# EAGLE design adsr_v3 (EAGLE 7.1.0)
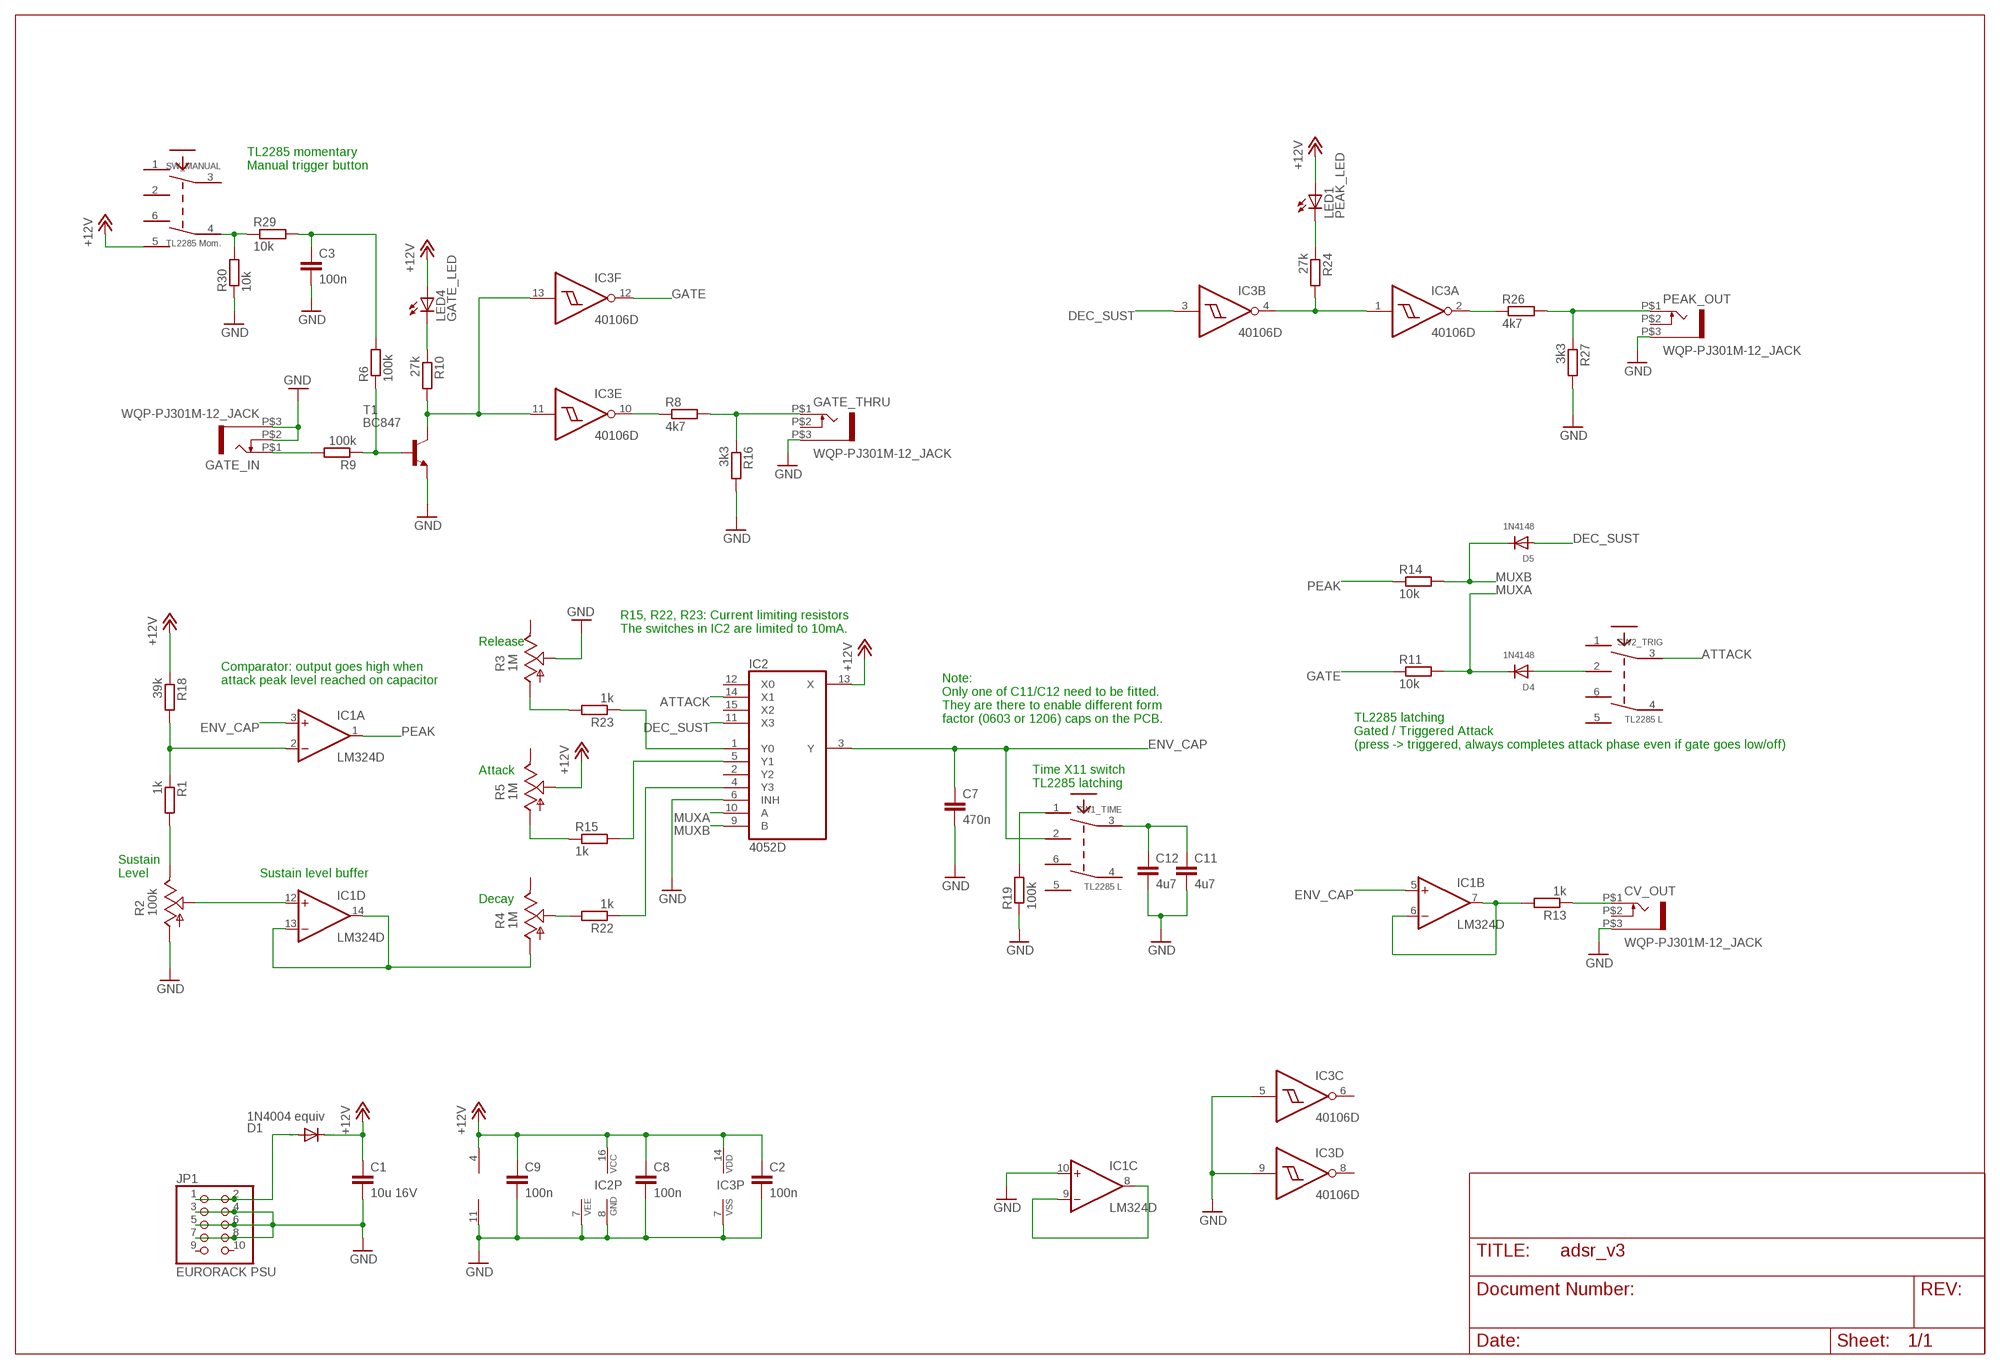
[diagram p0: schematic, sheet 1]

## Parts
C1  10u 16V  C-EUC1206K  [C1206K]
C2  100n  C-EUC0603K  [C0603K]
C3  100n  C-EUC0603K  [C0603K]
C7  470n  C-EUC0603K  [C0603K]
C8  100n  C-EUC0603K  [C0603K]
C9  100n  C-EUC0603K  [C0603K]
C11  4u7  C-EUC1206K  [C1206K]
C12  4u7  C-EUC0603K  [C0603K]
CV_OUT  WQP-PJ301M-12_JACK  [WQP-PJ301M-12_JACK]
D1  1N4004 equiv  DIODE-DO214AA  [DO214AA]
D4  1N4148  DIODESOD-323F  [SOD-323F]
D5  1N4148  DIODESOD-323F  [SOD-323F]
GATE_IN  WQP-PJ301M-12_JACK  [WQP-PJ301M-12_JACK]
GATE_THRU  WQP-PJ301M-12_JACK  [WQP-PJ301M-12_JACK]
IC1  LM324D  [SO14]
IC2  4052D  [SO16]
IC3  40106D  [SO14]
JP1  EURORACK PSU  PINHD-2X5  [2X05]
LED1  PEAK_LED  LED5MM  [LED5MM]
LED4  GATE_LED  LED5MM  [LED5MM]
PEAK_OUT  WQP-PJ301M-12_JACK  [WQP-PJ301M-12_JACK]
R1  1k  R-EU_R0603  [R0603]
R2  100k  POT_USVERTICAL  [ALPS_POT_VERTICAL]
R3  1M  POT_USVERTICAL  [ALPS_POT_VERTICAL]
R4  1M  POT_USVERTICAL  [ALPS_POT_VERTICAL]
R5  1M  POT_USVERTICAL  [ALPS_POT_VERTICAL]
R6  100k  R-EU_R0603  [R0603]
R8  4k7  R-EU_R0603  [R0603]
R9  100k  R-EU_R0603  [R0603]
R10  27k  R-EU_R0603  [R0603]
R11  10k  R-EU_R0603  [R0603]
R13  1k  R-EU_R0603  [R0603]
R14  10k  R-EU_R0603  [R0603]
R15  1k  R-EU_R0603  [R0603]
R16  3k3  R-EU_R0603  [R0603]
R18  39k  R-EU_R0603  [R0603]
R19  100k  R-EU_R0603  [R0603]
R22  1k  R-EU_R0603  [R0603]
R23  1k  R-EU_R0603  [R0603]
R24  27k  R-EU_R0603  [R0603]
R26  4k7  R-EU_R0603  [R0603]
R27  3k3  R-EU_R0603  [R0603]
R29  10k  R-EU_R0603  [R0603]
R30  10k  R-EU_R0603  [R0603]
SW1_TIME  TL2285 L  TL2285  [TL2285_PCB]
SW2_TRIG  TL2285 L  TL2285  [TL2285_PCB]
SW_MANUAL  TL2285 Mom.  TL2285  [TL2285_PCB]
T1  BC847  [SOT23]

## Nets
+12V: C1.1 C2.1 C8.1 C9.1 D1.C IC1.4(P:V+) IC2.13(X) IC2.16(VCC) IC3.14(P:VDD) LED1.A LED4.A R5.P$2(S) R18.1 SW_MANUAL.5
ATTACK: IC2.14(X1) SW2_TRIG.3
ATTACK_REF: IC1.2(A:-IN) R1.1 R18.2
DEC_SUST: D5.A IC2.11(X3) IC3.3(B:I)
ENV_CAP: C7.1 IC1.3(A:+IN) IC1.5(B:+IN) IC2.3(Y) SW1_TIME.2
GATE: IC3.12(F:O) R11.1
GATE_IN: IC3.11(E:I) IC3.13(F:I) R10.2 T1.3(C)
GND: C1.2 C2.2 C3.2 C7.2 C8.2 C9.2 C11.2 C12.2 CV_OUT.P$3 GATE_IN.P$2 GATE_IN.P$3 GATE_THRU.P$3 IC1.10(C:+IN) IC1.11(P:V-) IC2.6(INH) IC2.7(VEE) IC2.8(GND) IC3.5(C:I) IC3.7(P:VSS) IC3.9(D:I) JP1.3 JP1.4 JP1.5 JP1.6 JP1.7 JP1.8 PEAK_OUT.P$3 R2.P$3(A) R3.P$2(S) R16.2 R19.1 R27.2 R30.1 T1.2(E)
MUXA: D4.C IC2.10(A) R11.2
MUXB: D5.C IC2.9(B) R14.2
N$1: IC3.10(E:O) R8.1
N$2: GATE_IN.P$1 R9.2
N$3: D1.A JP1.1 JP1.2
N$4: R29.1 R30.2 SW_MANUAL.4
N$5: IC2.1(Y0) R23.1
N$6: IC2.4(Y3) R22.1
N$7: IC1.13(D:-IN) IC1.14(D:OUT) R4.P$3(A)
N$8: IC3.2(A:O) R26.1
N$10: IC2.5(Y1) R15.2
N$11: CV_OUT.P$1 R13.1
N$12: IC1.6(B:-IN) IC1.7(B:OUT) R13.2
N$13: GATE_THRU.P$1 R8.2 R16.1
N$15: C3.1 R6.2 R29.2
N$16: C11.1 C12.1 SW1_TIME.3
N$18: R19.2 SW1_TIME.1
N$21: R6.1 R9.1 T1.1(B)
N$22: LED4.K(C) R10.1
N$23: R3.P$3(A) R23.2
N$24: IC1.8(C:OUT) IC1.9(C:-IN)
N$25: R5.P$3(A) R15.1
N$26: R1.2 R2.P$1(E)
N$27: D4.A SW2_TRIG.2
N$28: R4.P$2(S) R22.2
N$30: IC3.1(A:I) IC3.4(B:O) R24.2
N$31: LED1.K(C) R24.1
N$35: PEAK_OUT.P$1 R26.2 R27.1
PEAK: IC1.1(A:OUT) R14.1
SUST_LEVEL: IC1.12(D:+IN) R2.P$2(S)
Unconnected: CV_OUT.P$2 GATE_THRU.P$2 IC2.2(Y2) IC2.12(X0) IC2.15(X2) IC3.6(C:O) IC3.8(D:O) JP1.9 JP1.10 PEAK_OUT.P$2 R3.P$1(E) R4.P$1(E) R5.P$1(E) SW1_TIME.4 SW1_TIME.5 SW1_TIME.6 SW2_TRIG.1 SW2_TRIG.4 SW2_TRIG.5 SW2_TRIG.6 SW_MANUAL.1 SW_MANUAL.2 SW_MANUAL.3 SW_MANUAL.6

## Notes on the sheet
- TL2285 momentary
  Manual trigger button
- R15, R22, R23: Current limiting resistors
  The switches in IC2 are limited to 10mA.
- Release
- Comparator: output goes high when
  attack peak level reached on capacitor
- Note:
  Only one of C11/C12 need to be fitted.
  They are there to enable different form
  factor (0603 or 1206) caps on the PCB.
- TL2285 latching
  Gated / Triggered Attack
  (press -> triggered, always completes attack phase even if gate goes low/off)
- Attack
- Time X11 switch
  TL2285 latching
- Sustain
  Level
- Sustain level buffer
- Decay

## Library data of the parts
C1-C3 C7-C9 C11 C12 = rcl:C-EU: CAPACITOR, European symbol
CV_OUT GATE_IN GATE_THRU PEAK_OUT = thonkiconn:WQP-PJ301M-12_JACK
D1 = diode:DIODE-: DIODE
D4 D5 = adafruit:DIODE: Diode SMADIODE - SMA Surface Mount Package 20V 1A Schottky Diode Digikey: 641-1014-6-ND DO-1N4148 - Through Hole Small Current Diode SOD-123 20V 1 A (.5mV Vf) Schottky Diode - Digikey: MBRX120TPMSCT-ND SOD-323 10V 570mA (.38mV Vf, 3ns) Schottky Diode - Digikey: ZLLS410CT-ND SOD-523 30V 30mA Schottky Diode (RB751S-40TE61) - Digikey: RB751S-40TE61CT-ND SOT23-R/W - SOT23 Package (R = Solder Paste/Reflow Ovens, W = Hand-Soldering) BAT54Film 40V 300mA - Digikey: 497-7162-1-ND
IC1 = linear:LM324: OP AMP
IC2 = 40xx:4052: Dual 4-channel ANALOG MULTIPLEXER
IC3 = 40xx:40106: Hex SCHMITT TRIGGER
JP1 = pinhead:PINHD-2X5: PIN HEADER
LED1 LED4 = led:LED: LED OSRAM: - CHIPLED LG R971, LG N971, LY N971, LG Q971, LY Q971, LO R971, LY R971 LH N974, LH R974 LS Q976, LO Q976, LY Q976 LO Q996 - Hyper CHIPLED LW Q18S LB Q993, LB Q99A, LB R99A - SideLED LS A670, LO A670, LY A670, LG A670, LP A670 LB A673, LV A673, LT A673, LW A673 LH A674 LY A675 LS A676, LA A676, LO A676, LY A676, LW A676 LS A679, LY A679, LG A679 - Hyper Micro SIDELED® LS Y876, LA Y876, LO Y876, LY Y876 LT Y87S - SmartLED LW L88C, LW L88S LB L89C, LB L89S, LG L890 LS L89K, LO L89K, LY L89K LS L896, LA L896, LO L896, LY L896 - TOPLED LS T670, LO T670, LY T670, LG T670, LP T670 LSG T670, LSP T670, LSY T670, LOP T670, LYG T670 LG T671, LOG T671, LSG T671 LB T673, LV T673, LT T673, LW T673 LH T674 LS T676, LA T676, LO T676, LY T676, LB T676, LH T676, LSB T676, LW T676 LB T67C, LV T67C, LT T67C, LS T67K, LO T67K, LY T67K, LW E67C LS E67B, LA E67B, LO E67B, LY E67B, LB E67C, LV E67C, LT E67C LW T67C LS T679, LY T679, LG T679 LS T770, LO T770, LY T770, LG T770, LP T770 LB T773, LV T773, LT T773, LW T773 LH T774 LS E675, LA E675, LY E675, LS T675 LS T776, LA T776, LO T776, LY T776, LB T776 LHGB T686 LT T68C, LB T68C - Hyper Mini TOPLED® LB M676 - Mini TOPLED Santana® LG M470 LS M47K, LO M47K, LY M47K Source: http://www.osram.convergy.de LUXEON: - LUMILED® LXK2-PW12-R00, LXK2-PW12-S00, LXK2-PW14-U00, LXK2-PW14-V00 LXK2-PM12-R00, LXK2-PM12-S00, LXK2-PM14-U00 LXK2-PE12-Q00, LXK2-PE12-R00, LXK2-PE12-S00, LXK2-PE14-T00, LXK2-PE14-U00 LXK2-PB12-K00, LXK2-PB12-L00, LXK2-PB12-M00, LXK2-PB14-N00, LXK2-PB14-P00, LXK2-PB14-Q00 LXK2-PR12-L00, LXK2-PR12-M00, LXK2-PR14-Q00, LXK2-PR14-R00 LXK2-PD12-Q00, LXK2-PD12-R00, LXK2-PD12-S00 LXK2-PH12-R00, LXK2-PH12-S00 LXK2-PL12-P00, LXK2-PL12-Q00, LXK2-PL12-R00 Source: www.luxeon.com KINGBRIGHT: KA-3528ASYC Source: www.kingbright.com
R1 R6 R8-R11 R13-R16 R18 R19 R22-R24 R26 R27 R29 R30 = rcl:R-EU_: RESISTOR, European symbol
R2-R5 = pot-alps:POT_US
SW1_TIME SW2_TRIG SW_MANUAL = lb_devs:TL2285: E-Switch TL2285 (PCB switch)
T1 = transistor:BC847: NPN TRANSISTOR

## Board
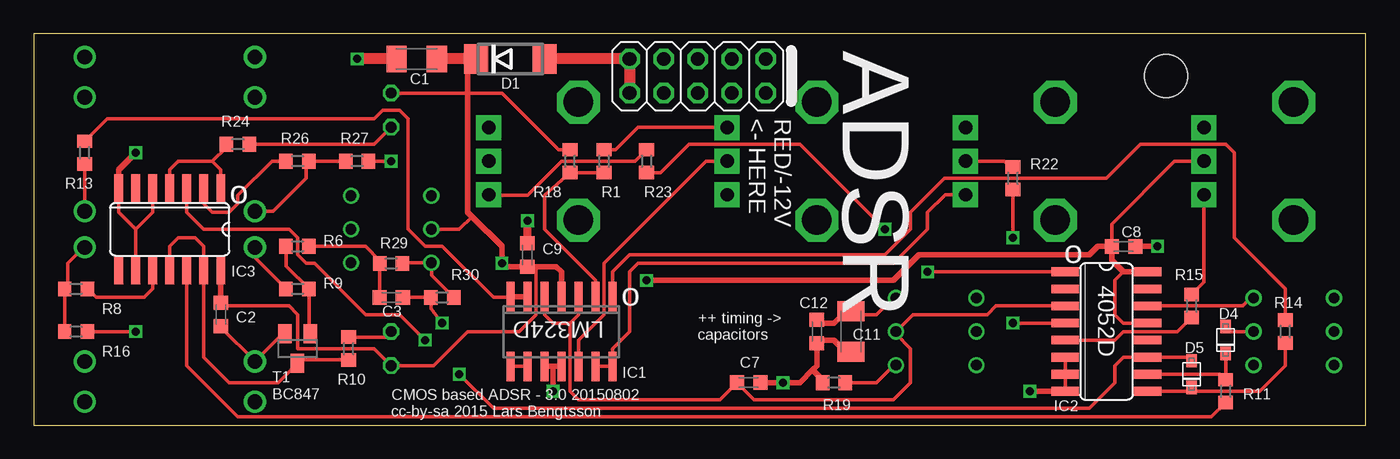
[diagram p1: board, top side]
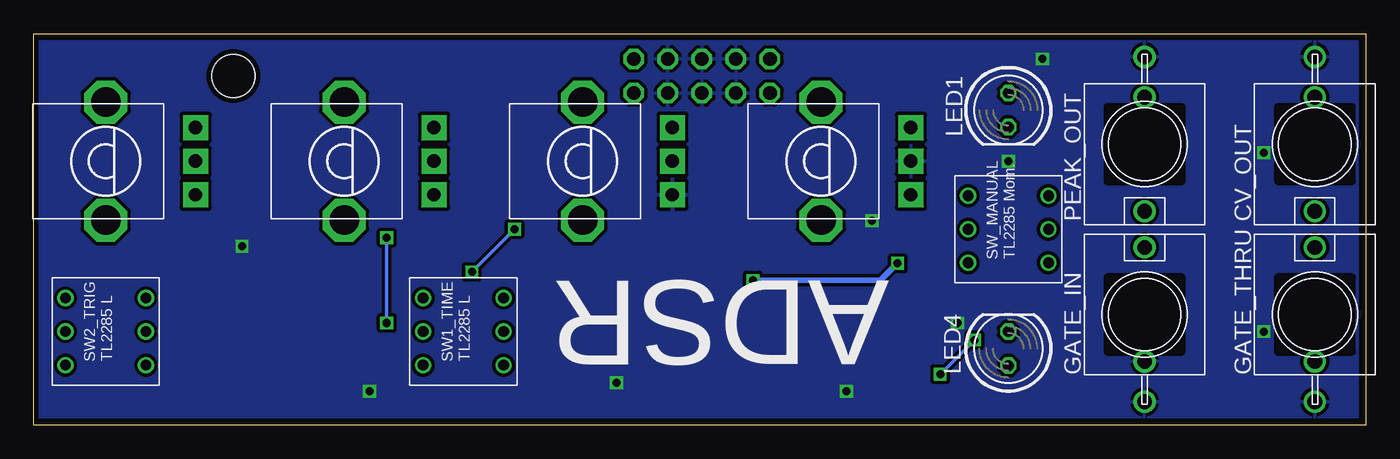
[diagram p2: board, bottom side, seen from below]

Size 99.36 x 29.2 mm. Coordinates in mm from the lower left corner, seen from the top.
Outline: 0,0 99.36,0 99.36,29.2 0,29.2 0,0
Copper layers (1*16): Top 0.0356mm / dielectric 1.5011mm / Bottom 0.0356mm
Design rules "LaenPCBOrder *": minimum track width 6mil, minimum drill 13mil, track to track 6mil, track to pad 6mil, pad to pad 6mil, via to via 6mil, smd to smd 6mil, copper to edge 15mil, drill to drill 6mil, minimum pad ring 7mil, minimum via ring 7mil, stop-mask expansion 3mil, vias tented up to drill 0mil, thermal gap 10mil
Holes 3.2 mm at 84.45,26.03

### Footprints (pad centres in the part's own frame; a part is rotated, then mirrored left to right if it is on the bottom)
C1206K = smd 1.5 x 2: 1 -1.5,0; 2 1.5,0
C0603K = smd 1.05 x 1.08: 1 -0.875,0; 2 0.875,0
WQP-PJ301M-12_JACK = drill 1.1: P$1 0,5; P$2 0,-3.5; P$3 0,-6.5
DO214AA = smd 1.8 x 2.2: A 2.55,0; C -2.55,0
SOD-323F = smd 1 x 0.8: A -1,0; C 1,0
SO14 = smd 0.6 x 2.2: 1 -3.81,-2.6; 2 -2.54,-2.6; 3 -1.27,-2.6; 4 0,-2.6; 5 1.27,-2.6; 6 2.54,-2.6; 7 3.81,-2.6; 8 3.81,2.6; 9 2.54,2.6; 10 1.27,2.6; 11 0,2.6; 12 -1.27,2.6; 13 -2.54,2.6; 14 -3.81,2.6
SO16 = smd 0.66 x 2.032: 1 -4.445,-3.073; 2 -3.175,-3.073; 3 -1.905,-3.073; 4 -0.635,-3.073; 5 0.635,-3.073; 6 1.905,-3.073; 7 3.175,-3.073; 8 4.445,-3.073; 9 4.445,3.073; 10 3.175,3.073; 11 1.905,3.073; 12 0.635,3.073; 13 -0.635,3.073; 14 -1.905,3.073; 15 -3.175,3.073; 16 -4.445,3.073
SO14' = smd 0.66 x 2.032: 1 -3.81,-3.073; 2 -2.54,-3.073; 3 -1.27,-3.073; 4 0,-3.073; 5 1.27,-3.073; 6 2.54,-3.073; 7 3.81,-3.073; 8 3.81,3.073; 9 2.54,3.073; 10 1.27,3.073; 11 0,3.073; 12 -1.27,3.073; 13 -2.54,3.073; 14 -3.81,3.073
2X05 = drill 1.016 octagon: 1 -5.08,-1.27; 2 -5.08,1.27; 3 -2.54,-1.27; 4 -2.54,1.27; 5 0,-1.27; 6 0,1.27; 7 2.54,-1.27; 8 2.54,1.27; 9 5.08,-1.27; 10 5.08,1.27
LED5MM = drill 0.813 octagon: A -1.27,0; K 1.27,0
R0603 = smd 1 x 1.1: 1 -0.85,0; 2 0.85,0
ALPS_POT_VERTICAL = drill 1 pad 1.88 square: P$1 -2.5,6.7; P$2 0,6.7; P$3 2.5,6.7 | drill 2.2 pad 3.175 octagon: P$4 -4.4,0; P$5 4.4,0
TL2285_PCB = drill 0.8: 1 -2.5,-3; 2 0,-3; 3 2.5,-3; 4 -2.5,3; 5 0,3; 6 2.5,3
SOT23 = smd 1 x 1.4: 1 -0.95,-1.1; 2 0.95,-1.1; 3 0,1.1

### Placement (x,y rotation side)
C1  28.57,27.3 180 top
C2  13.97,8.26 270 top
C3  26.67,9.53 0 top
C7  53.34,3.18 0 top
C8  81.28,13.33 0 top
C9  36.83,12.7 90 top
C11  60.96,6.99 270 top
C12  58.42,6.99 270 top
CV_OUT  3.81,20.95 180 bottom
D1  35.56,27.3 0 top
D4  88.9,6.35 270 top
D5  86.36,3.81 270 top
GATE_IN  16.51,8.26 0 bottom
GATE_THRU  3.81,8.26 0 bottom
IC1  39.37,6.99 180 top
IC2  80.01,6.99 270 top
IC3  40106D  [SO14']  10.16,14.6 180 top
JP1  49.53,26.03 0 top
LED1  26.67,23.49 270 bottom
LED4  26.67,5.72 90 bottom
PEAK_OUT  16.51,20.95 180 bottom
R1  42.55,19.69 90 top
R2  58.42,19.69 270 bottom
R3  40.64,19.69 270 bottom
R4  76.2,19.69 270 bottom
R5  93.98,19.69 270 bottom
R6  19.68,13.33 0 top
R8  3.17,10.16 180 top
R9  19.68,10.16 180 top
R10  23.5,5.72 270 top
R11  88.9,2.54 90 top
R13  3.81,20.32 90 top
R14  93.34,6.99 270 top
R15  86.36,8.89 270 top
R16  3.17,6.99 0 top
R18  40.01,19.69 270 top
R19  59.69,3.18 0 top
R22  73.03,18.41 90 top
R23  45.72,19.69 90 top
R24  15.24,20.95 180 top
R26  19.68,19.69 0 top
R27  24.13,19.69 0 top
R29  26.67,12.06 180 top
R30  30.48,9.53 0 top
SW1_TIME  67.31,6.99 90 bottom
SW2_TRIG  93.98,6.99 90 bottom
SW_MANUAL  26.67,14.6 90 bottom
T1  19.68,5.72 180 top

### Tracks (layer width: path | path; a pad name or v marks a point on that pad's centre or on a via)
+12V  (via drill 0.6)
  Top 0.254: 37.47,11.83 37.47,8.26 36.2,6.99 32.38,6.99 29.84,4.45 LED4.A 25.4,5.72 19.68,5.72 19.68,8.26 19.05,8.89 14.21,8.89 C2.1 | C8.1 80.41,15 85.09,19.69 R5.P$2 | SW_MANUAL.5 31.75,14.6 32.7,15.56 | LED1.A 32.38,24.77 34.92,24.77 39.16,20.53 R18.1 | IC2.13 81.28,7.62 80.64,8.26 80.64,10.79 81.28,11.43
  Top 0.406: IC1.4 39.37,11.43 38.98,11.83 37.47,11.83 C9.1 35.16,11.83 v34.92,12.06 34.92,13.33 32.7,15.56 32.38,15.88 32.38,24.77 32.38,27.3 | v45.72,10.79 64.14,10.79 66.04,12.7 78.74,12.7 79.38,13.33 C8.1 80.41,12.31 81.28,11.43 IC2.16 | IC3.14 C2.1
  Top 0.813: D1.C 32.38,27.3 C1.1
  Bottom 0.406: v34.92,12.06 36.2,10.79 v45.72,10.79
ATTACK
  Top 0.254: SW2_TRIG.3 90.77,9.49 90.17,8.89 IC2.14
ATTACK_REF
  Top 0.254: R1.1 R18.2 38.1,17.15 38.1,14.6 41.91,10.79 IC1.2
DEC_SUST  (via drill 0.6)
  Top 0.254: IC3.3 11.43,15.88 12.7,14.6 19.05,14.6 19.68,13.97 19.68,12.7 20.32,12.06 20.95,12.06 24.77,8.26 27.3,8.26 v29.21,6.35 | v31.75,3.81 34.29,1.27 78.74,1.27 80.64,3.18 80.64,4.45 81.28,5.08 IC2.11 86.09,5.08 D5.A
  Bottom 0.254: v29.21,6.35 v31.75,3.81
ENV_CAP
  Top 0.254: IC1.5 38.1,8.26 38.73,7.62 40.01,7.62 | IC1.3 40.64,8.26 40.01,7.62 | 40.01,7.62 40.01,2.54 40.64,1.9 51.2,1.9 C7.1 53.73,1.9 64.14,1.9 65.41,3.18 65.41,5.72 64.31,6.81 SW1_TIME.2 65.58,8.26 71.12,8.26 71.75,8.89 IC2.3
GATE
  Top 0.254: IC3.12 11.43,4.45 15.24,0.63 87.84,0.63 R11.1
GATE_IN
  Top 0.254: 19.86,4.45 T1.3 | T1.3 18.25,3.18 14.61,3.18 12.7,5.08 IC3.13 12.7,13.33 12.06,13.97 10.79,13.97 10.16,13.33 IC3.11 | R10.2 19.93,4.87 T1.3
GND  (via drill 0.6)
  Top 0.254: IC2.8 IC2.7 IC2.6 | C3.2 R30.1 29.63,8.67 v30.48,7.62 | C2.2 13.97,7.29 GATE_IN.P$2 18.57,6.81 T1.2 | IC3.5 8.89,15.88 7.62,14.6 | 7.62,14.6 6.35,15.88 IC3.7 | R16.2 v7.62,6.99 | IC3.9 7.62,14.6 | R27.2 v26.67,19.69
  Top 0.406: IC1.10 38.73,4.38 | 38.73,4.38 IC1.11 | IC2.8 v74.3,2.54 | C7.2 v55.88,3.18 57.15,3.18 58.1,4.13 | 58.1,4.13 58.42,4.45 C12.2 58.66,6.35 59.69,6.35 60.55,5.49 C11.2 | R19.1 58.84,3.39 58.1,4.13 | v83.82,13.33 C8.2 | v38.73,2.54 38.73,4.38 | v7.62,20.32 6.35,19.05 IC3.7
  Top 0.61: C9.2 v36.83,15.24
  Top 0.813: C1.2 v24.13,27.3
  pour Bottom (isolate 0.254): 0.64,28.57 99.06,28.57 99.06,0.63 0.64,0.63
MUXA
  Top 0.254: IC2.10 88.48,3.81 R11.2 D4.C
MUXB
  Top 0.254: IC2.9 86.09,2.54 D5.C 86.63,2.54 91.44,2.54 93.34,4.45 R14.2
N$1
  Top 0.254: IC3.10 8.89,10.16 8.26,9.53 4.66,9.53 R8.1
N$2
  Top 0.254: GATE_IN.P$1 16.51,12.49 R9.2
N$3
  Top 0.813: JP1.1 JP1.2 D1.A
N$4
  Top 0.254: R29.1 27.56,12.1 SW_MANUAL.4 29.67,11.19 R30.2
N$5  (via drill 0.6)
  Top 0.254: R23.1 46.77,18.84 48.9,20.95 57.15,20.95 v63.5,14.6 | IC2.1 v66.67,11.43
  Bottom 0.254: v63.5,14.6 66.36,11.75 v66.67,11.43
N$6  (via drill 0.6)
  Top 0.254: v73.03,7.62 IC2.4 | R22.1 v73.03,13.97
  Bottom 0.254: v73.03,13.97 v73.03,7.62
N$7
  Top 0.254: IC1.13 IC1.14 | 43.18,3.81 IC1.14 | IC1.14 43.18,5.72 44.45,6.99 44.45,11.43 45.09,12.06 64.14,12.06 66.67,14.6 66.67,15.88 67.98,17.19 R4.P$3
N$8
  Top 0.254: IC3.2 12.7,16.51 13.34,15.88 14.61,15.88 15.24,16.51 15.24,17.15 17.78,19.69 R26.1
N$10
  Top 0.254: IC2.5 80.64,6.35 81.28,6.99 85.31,6.99 R15.2
N$11
  Top 0.254: R13.1 CV_OUT.P$1
N$12
  Top 0.254: IC1.7 35.5,9.53 34.29,9.53 30.48,13.33 29.21,13.33 27.94,14.6 27.94,22.86 27.3,23.49 26.04,23.49 25.4,22.86 5.5,22.86 R13.2
  Top 0.406: IC1.7 IC1.6
N$13
  Top 0.254: GATE_THRU.P$1 3.73,13.26 2.54,12.06 2.54,10.38 R8.2 R16.1
N$15
  Top 0.254: C3.1 25.82,9.55 R29.2 25.82,12.28 24.77,13.33 R6.2
N$16
  Top 0.254: SW1_TIME.3 64.09,9.49 62.87,8.26 61.19,8.26 C11.1
  Top 0.406: C11.1 60.55,8.49 59.69,7.62 58.66,7.62 C12.1
N$18
  Top 0.254: SW1_TIME.1 64.17,4.48 62.87,3.18 R19.2
N$21
  Top 0.254: T1.1 20.54,6.92 R9.1 18.84,11.86 R6.1
N$22
  Top 0.254: R10.1 26.25,6.56 LED4.K
N$23
  Top 0.254: R3.P$3 33.98,17.15 36.83,17.15 39.37,19.69 44.87,19.69 R23.2
N$24
  Top 0.254: IC1.9 IC1.8
N$25
  Top 0.254: R5.P$3 87.28,10.66 R15.1
N$26
  Top 0.254: R1.2 43.4,20.53 45.09,22.23 51.68,22.23 R2.P$1
N$27
  Top 0.254: SW2_TRIG.2 89.27,6.99 D4.A
N$28
  Top 0.254: R22.2 72.81,19.27 72.39,19.69 R4.P$2
N$30
  Top 0.254: IC3.1 13.97,19.05 13.34,19.69 | 13.34,19.69 10.79,19.69 10.16,19.05 IC3.4 | R24.2 14.39,20.74 13.34,19.69
N$31
  Top 0.254: R24.1 25.4,20.95 LED1.K
N$35
  Top 0.254: PEAK_OUT.P$1 17.86,15.96 20.32,18.41 20.32,19.47 R26.2 | R26.2 20.32,19.69 | R26.2 R27.1
PEAK
  Top 0.254: IC1.1 43.18,11.43 44.45,12.7 63.5,12.7 65.41,14.6 65.41,15.88 67.94,18.41 80.01,18.41 82.55,20.95 88.9,20.95 89.53,20.32 89.53,13.97 93.34,10.16 R14.1
SUST_LEVEL
  Top 0.254: IC1.12 40.64,6.35 42.55,8.26 42.55,12.06 50.16,19.69 R2.P$2

### Text on the board
tNames: ADSR | RED/-12V / <- HERE | o | o | o | ++ timing -> / capacitors | CMOS based ADSR - 3.0 20150802 / cc-by-sa 2015 Lars Bengtsson
bNames: ADSR